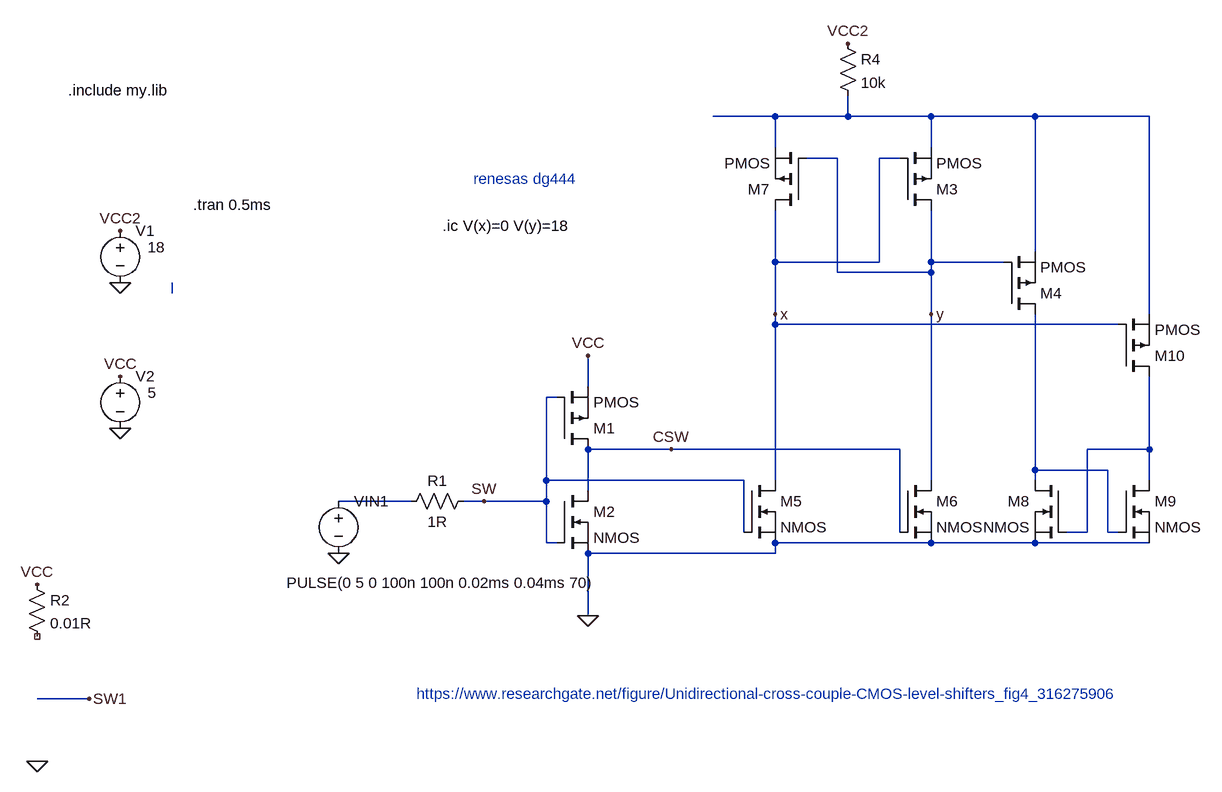
[diagram p0: schematic Draft60.asc]
Draft60.asc, the LTspice schematic file:
Version 4
SHEET 1 2756 1020
WIRE 992 -256 896 -256
WIRE 1104 -256 1104 -288
WIRE 1104 -256 992 -256
WIRE 1232 -256 1104 -256
WIRE 1392 -256 1232 -256
WIRE 1568 -256 1392 -256
WIRE 992 -208 992 -256
WIRE 1232 -208 1232 -256
WIRE 1088 -192 1040 -192
WIRE 1184 -192 1152 -192
WIRE 1392 -48 1392 -256
WIRE 992 -32 992 -112
WIRE 1152 -32 1152 -192
WIRE 1152 -32 992 -32
WIRE 1232 -32 1232 -112
WIRE 1344 -32 1232 -32
WIRE 1088 -16 1088 -192
WIRE 1232 -16 1232 -32
WIRE 1232 -16 1088 -16
WIRE 64 16 64 0
WIRE 992 48 992 -32
WIRE 1232 48 1232 -16
WIRE 1568 48 1568 -256
WIRE 992 64 992 48
WIRE 1520 64 992 64
WIRE 704 160 704 112
WIRE 656 176 640 176
WIRE 832 256 704 256
WIRE 1184 256 832 256
WIRE 1568 256 1568 144
WIRE 1568 256 1472 256
WIRE 1392 288 1392 48
WIRE 1504 288 1392 288
WIRE 640 304 640 176
WIRE 944 304 640 304
WIRE 992 304 992 64
WIRE 1232 304 1232 48
WIRE 1392 304 1392 288
WIRE 1568 304 1568 256
WIRE 704 320 704 256
WIRE 432 336 320 336
WIRE 544 336 512 336
WIRE 640 336 640 304
WIRE 640 336 544 336
WIRE 944 384 944 304
WIRE 1184 384 1184 256
WIRE 1472 384 1472 256
WIRE 1472 384 1440 384
WIRE 1504 384 1504 288
WIRE 1520 384 1504 384
WIRE 640 400 640 336
WIRE 656 400 640 400
WIRE 992 400 992 384
WIRE 1232 400 992 400
WIRE 1392 400 1232 400
WIRE 1568 400 1392 400
WIRE 992 416 992 400
WIRE 992 416 704 416
WIRE 704 512 704 416
WIRE -64 640 -144 640
FLAG -16 0 0
FLAG -16 -80 VCC2
FLAG 544 336 SW
FLAG 320 416 0
FLAG 832 256 CSW
FLAG 704 512 0
FLAG -16 224 0
FLAG -16 144 VCC
FLAG 704 112 VCC
FLAG 1104 -368 VCC2
FLAG 992 48 x
FLAG 1232 48 y
FLAG -144 464 VCC
FLAG -144 736 0
FLAG -64 640 SW1
SYMBOL voltage -16 -96 R0
WINDOW 123 0 0 Left 0
WINDOW 39 0 0 Left 0
WINDOW 3 42 41 Left 2
SYMATTR Value 18
SYMATTR InstName V1
SYMBOL voltage 320 320 R0
WINDOW 123 0 0 Left 0
WINDOW 39 0 0 Left 0
WINDOW 3 -80 141 Left 2
SYMATTR Value PULSE(0 5 0 100n 100n 0.02ms 0.04ms 70)
SYMATTR InstName VIN1
SYMBOL voltage -16 128 R0
WINDOW 123 0 0 Left 0
WINDOW 39 0 0 Left 0
WINDOW 3 42 41 Left 2
SYMATTR Value 5
SYMATTR InstName V2
SYMBOL nmos 944 304 R0
SYMATTR InstName M5
SYMBOL nmos 1184 304 R0
SYMATTR InstName M6
SYMBOL res 528 320 R90
WINDOW 0 0 56 VBottom 2
WINDOW 3 32 56 VTop 2
SYMATTR InstName R1
SYMATTR Value 1R
SYMBOL pmos 1040 -112 R180
SYMATTR InstName M7
SYMBOL pmos 1184 -112 M180
SYMATTR InstName M3
SYMBOL pmos 1344 48 M180
SYMATTR InstName M4
SYMBOL nmos 1440 304 M0
SYMATTR InstName M8
SYMBOL nmos 1520 304 R0
SYMATTR InstName M9
SYMBOL pmos 1520 144 M180
SYMATTR InstName M10
SYMBOL res 1088 -384 R0
SYMATTR InstName R4
SYMATTR Value 10k
SYMBOL res -160 448 R0
SYMATTR InstName R2
SYMATTR Value 0.01R
SYMBOL pmos 656 256 M180
SYMATTR InstName M1
SYMBOL nmos 656 320 R0
SYMATTR InstName M2
TEXT 96 -120 Left 2 !.tran 0.5ms
TEXT 440 632 Left 2 ;https://www.researchgate.net/figure/Unidirectional-cross-couple-CMOS-level-shifters_fig4_316275906
TEXT 528 -160 Left 2 ;renesas dg444
TEXT 480 -88 Left 2 !.ic V(x)=0 V(y)=18
TEXT -96 -296 Left 2 !.include my.lib

The netlist it stands for:
* Draft60.asc
V1 VCC2 0 18
VIN1 N005 0 PULSE(0 5 0 100n 100n 0.02ms 0.04ms 70)
V2 VCC 0 5
M5 x SW 0 0 NMOS
M6 y CSW 0 0 NMOS
R1 SW N005 1R
M7 x y N001 N001 PMOS
M3 y x N001 N001 PMOS
M4 N004 y N001 N001 PMOS
M8 N004 N003 0 0 NMOS
M9 N003 N004 0 0 NMOS
M10 N003 x N001 N001 PMOS
R4 VCC2 N001 10k
R2 VCC NC_01 0.01R
M1 CSW SW VCC VCC PMOS
M2 CSW SW 0 0 NMOS
.model NMOS NMOS
.model PMOS PMOS
.lib standard.mos
.tran 0.5ms
* https://www.researchgate.net/figure/Unidirectional-cross-couple-CMOS-level-shifters_fig4_316275906
* renesas dg444
.ic V(x)=0 V(y)=18
.include my.lib
.backanno
.end